# EasyEDA schematic SCH_tec-APUS 7_2022-02-12.json
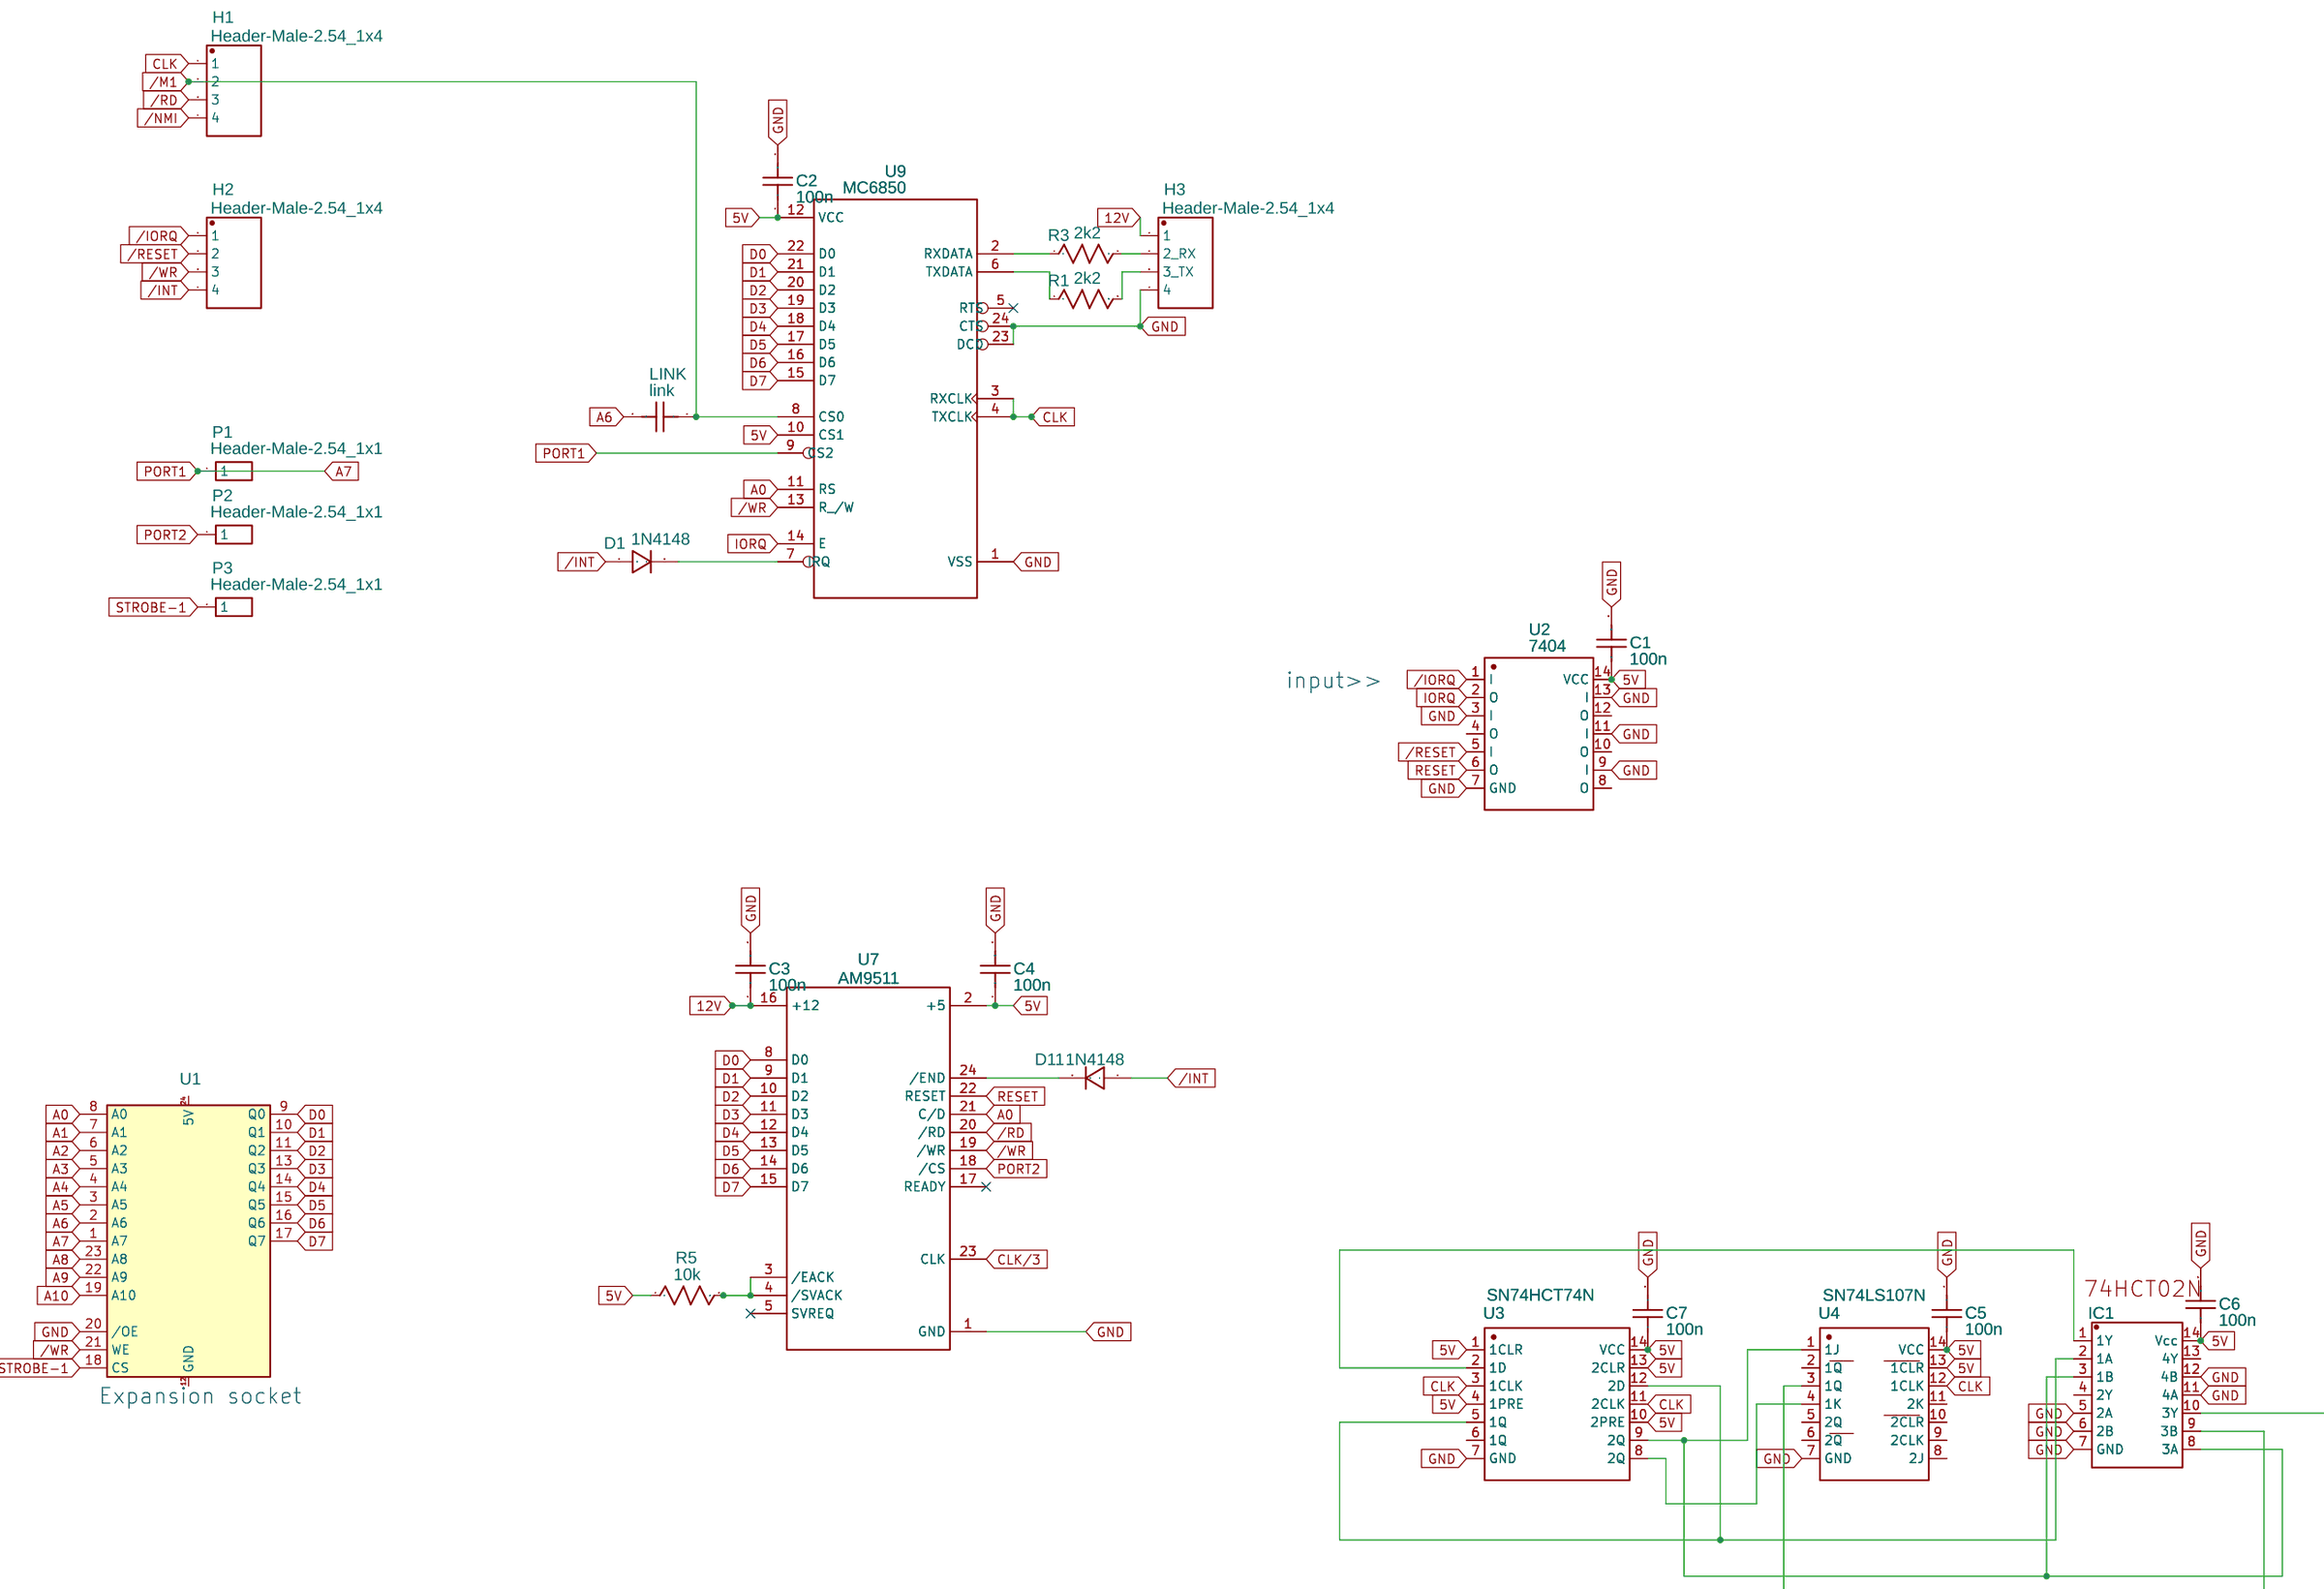
[diagram p0: schematic sheet]

## Parts
C1  100n  [RAD-0.1]
C2  100n  [RAD-0.1]
C3  100n  [RAD-0.1]
C4  100n  [RAD-0.1]
C5  100n  [RAD-0.1]
C6  100n  [RAD-0.1]
C7  100n  [RAD-0.1]
D1  1N4148  [DO-35]
D11  1N4148  [DO-35]
H1  Header-Male-2.54_1x4  [HDR-TH_4P-P2.54-V]
H2  Header-Male-2.54_1x4  [HDR-TH_4P-P2.54-V]
H3  Header-Male-2.54_1x4  [HDR-TH_4P-P2.54-V]
IC1  x74HCT02N  [NDIP-14]
LINK  link  [RAD-0.1]
P1  Header-Male-2.54_1x1  [HDR-TH_1P-P2.54-V-M]
P2  Header-Male-2.54_1x1  [HDR-TH_1P-P2.54-V-M]
P3  Header-Male-2.54_1x1  [HDR-TH_1P-P2.54-V-M]
R1  2k2  [R_AXIAL-0.3]
R3  2k2  [R_AXIAL-0.3]
R5  10k  [R_AXIAL-0.3]
U1  6116  [DIP-24_L31.0-W13.5-P2.54-LS15.2-BL]
U2  7404  [DIP14]
U3  SN74HCT74N  [DIP14]
U4  SN74LS107N  [DIP-14_L19.0-W7.0-P2.54-LS7.6-BL]
U7  AM9511  [DIP-24_L31.0-W13.5-P2.54-LS15.2-BL]
U9  MC6850  [DIP24-600]

## Library data of the parts
C1-C7 LINK = C_RAD-0.1_US: Contributor: LCEDA_Lib
D1 D11 = -: Supplier: LCSC; Manufacturer: SEMTECH; Manufacturer Part: 1N4448; image: //image.lceda.cn/szlcsc/C54037.jpg; Supplier Part: C54037
H1-H3 = Header-Male-2.54_1x4: Supplier: LCSC; Manufacturer: Ckmtw; Manufacturer Part: 210S-1*4P L=11.6MMGold-plated black; Contributor: LCSC; Supplier Part: C124378
IC1 = x74HCT02N: Contributor: karlab
P1-P3 = Header-Male-2.54_1x1: Supplier: LCSC; Manufacturer: ReliaPro; Supplier Part: C81276; JLCPCB Part Class: Extended Part
R1 R3 R5 = R_AXIAL-0.3_US: Contributor: LCEDA_Lib
U1 = -: Contributor: KiCAD; license: https://www.gnu.org/licenses/lgpl-2.1.html; Manufacturer Part: ?
U2 = 7404
U3 = SN74HCT74N
U4 = SN74LS107N: Supplier: LCSC; Manufacturer: TI; image: //image.lceda.cn/szlcsc/C5262.jpg; Supplier Part: C5262; Contributor: Jayzz12
U7 = AM9511: Manufacturer: AMD; Supplier: eBay; Contributor: itsallgoodjames
U9 = -: sourceId: EiO60izRL; Manufacturer Part: ?

## Nets
5V: C1.1 C2.1 C4.1 C5.1 C6.1 C7.1 IC1.14(Vcc) R5.1 U2.14(VCC) U3.1(1CLR) U3.4(1PRE) U3.10(2PRE) U3.13(2CLR) U3.14(VCC) U4.13(1CLR) U4.14(VCC) U7.2(+5) U9.10(CS1) U9.12(VCC)
12V: C3.1 H3.1 U7.16(+12)
GND: C1.2 C2.2 C3.2 C4.2 C5.2 C6.2 C7.2 H3.4 IC1.5(2A) IC1.6(2B) IC1.7(GND) IC1.11(4A) IC1.12(4B) U1.20(/OE) U2.3(I) U2.7(GND) U2.9(I) U2.11(I) U2.13(I) U3.7(GND) U4.7(GND) U7.1(GND) U9.1(VSS) U9.23(DCD) U9.24(CTS)
/INT: D1.1(A) D11.1(A) H2.4
/IORQ: H2.1 U2.1(I)
/M1: H1.2 LINK.1 U9.8(CS0)
/NMI: H1.4
/RD: H1.3 U7.20(/RD)
/RESET: H2.2 U2.5(I)
/WR: H2.3 U1.21(WE) U7.19(/WR) U9.13(R /W)
A0: U1.8(A0) U7.21(C/D) U9.11(RS)
A1: U1.7(A1)
A2: U1.6(A2)
A3: U1.5(A3)
A4: U1.4(A4)
A5: U1.3(A5)
A6: LINK.2 U1.2(A6)
A7: P1.1 U1.1(A7) U9.9(CS2)
A8: U1.23(A8)
A9: U1.22(A9)
A10: U1.19(A10)
CLK: H1.1 U3.3(1CLK) U3.11(2CLK) U4.12(1CLK) U9.3(RXCLK) U9.4(TXCLK)
CLK/3: IC1.10(3Y) U7.23(CLK)
D0: U1.9(Q0) U7.8(D0) U9.22(D0)
D1: U1.10(Q1) U7.9(D1) U9.21(D1)
D2: U1.11(Q2) U7.10(D2) U9.20(D2)
D3: U1.13(Q3) U7.11(D3) U9.19(D3)
D4: U1.14(Q4) U7.12(D4) U9.18(D4)
D5: U1.15(Q5) U7.13(D5) U9.17(D5)
D6: U1.16(Q6) U7.14(D6) U9.16(D6)
D7: U1.17(Q7) U7.15(D7) U9.15(D7)
IORQ: U2.2(O) U9.14(E)
PORT2: P2.1 U7.18(/CS)
RESET: U2.6(O) U7.22(RESET)
STROBE-1: P3.1 U1.18(CS)
Net-(D1-2): D1.2(K) U9.7(IRQ)
Net-(D11-2): D11.2(K) U7.24(/END)
Net-(H3-2): H3.2(2 RX) R3.2
Net-(H3-3): H3.3(3 TX) R1.2
Net-(IC1-1): IC1.1(1Y) U3.2(1D)
Net-(IC1-2): IC1.2(1A) U3.5(1Q) U3.12(2D)
Net-(IC1-3): IC1.3(1B) IC1.8(3A) U3.9(2Q) U4.1(1J)
Net-(IC1-9): IC1.9(3B) U4.3(1Q)
Net-(R1-1): R1.1 U9.6(TXDATA)
Net-(R3-1): R3.1 U9.2(RXDATA)
Net-(R5-2): R5.2 U7.3(/EACK) U7.4(/SVACK)
Net-(U3-8): U3.8(2Q) U4.4(1K)

Not connected (* = marked no-connect by the designer): IC1 4(2Y) 13(4Y); U1 12(GND) 24(5V); U2 4(O) 8(O) 10(O) 12(O); U3 6(1Q); U4 2(1Q) 5(2Q) 6(2Q) 8(2J) 9(2CLK) 10(2CLR) 11(2K); U7 5(SVREQ)* 17(READY)*; U9 5(RTS)*

## Notes on the sheet
- input>>
- Expansion socket
